# EAGLE design N64_RX_V2.0 (EAGLE 7.6.0)
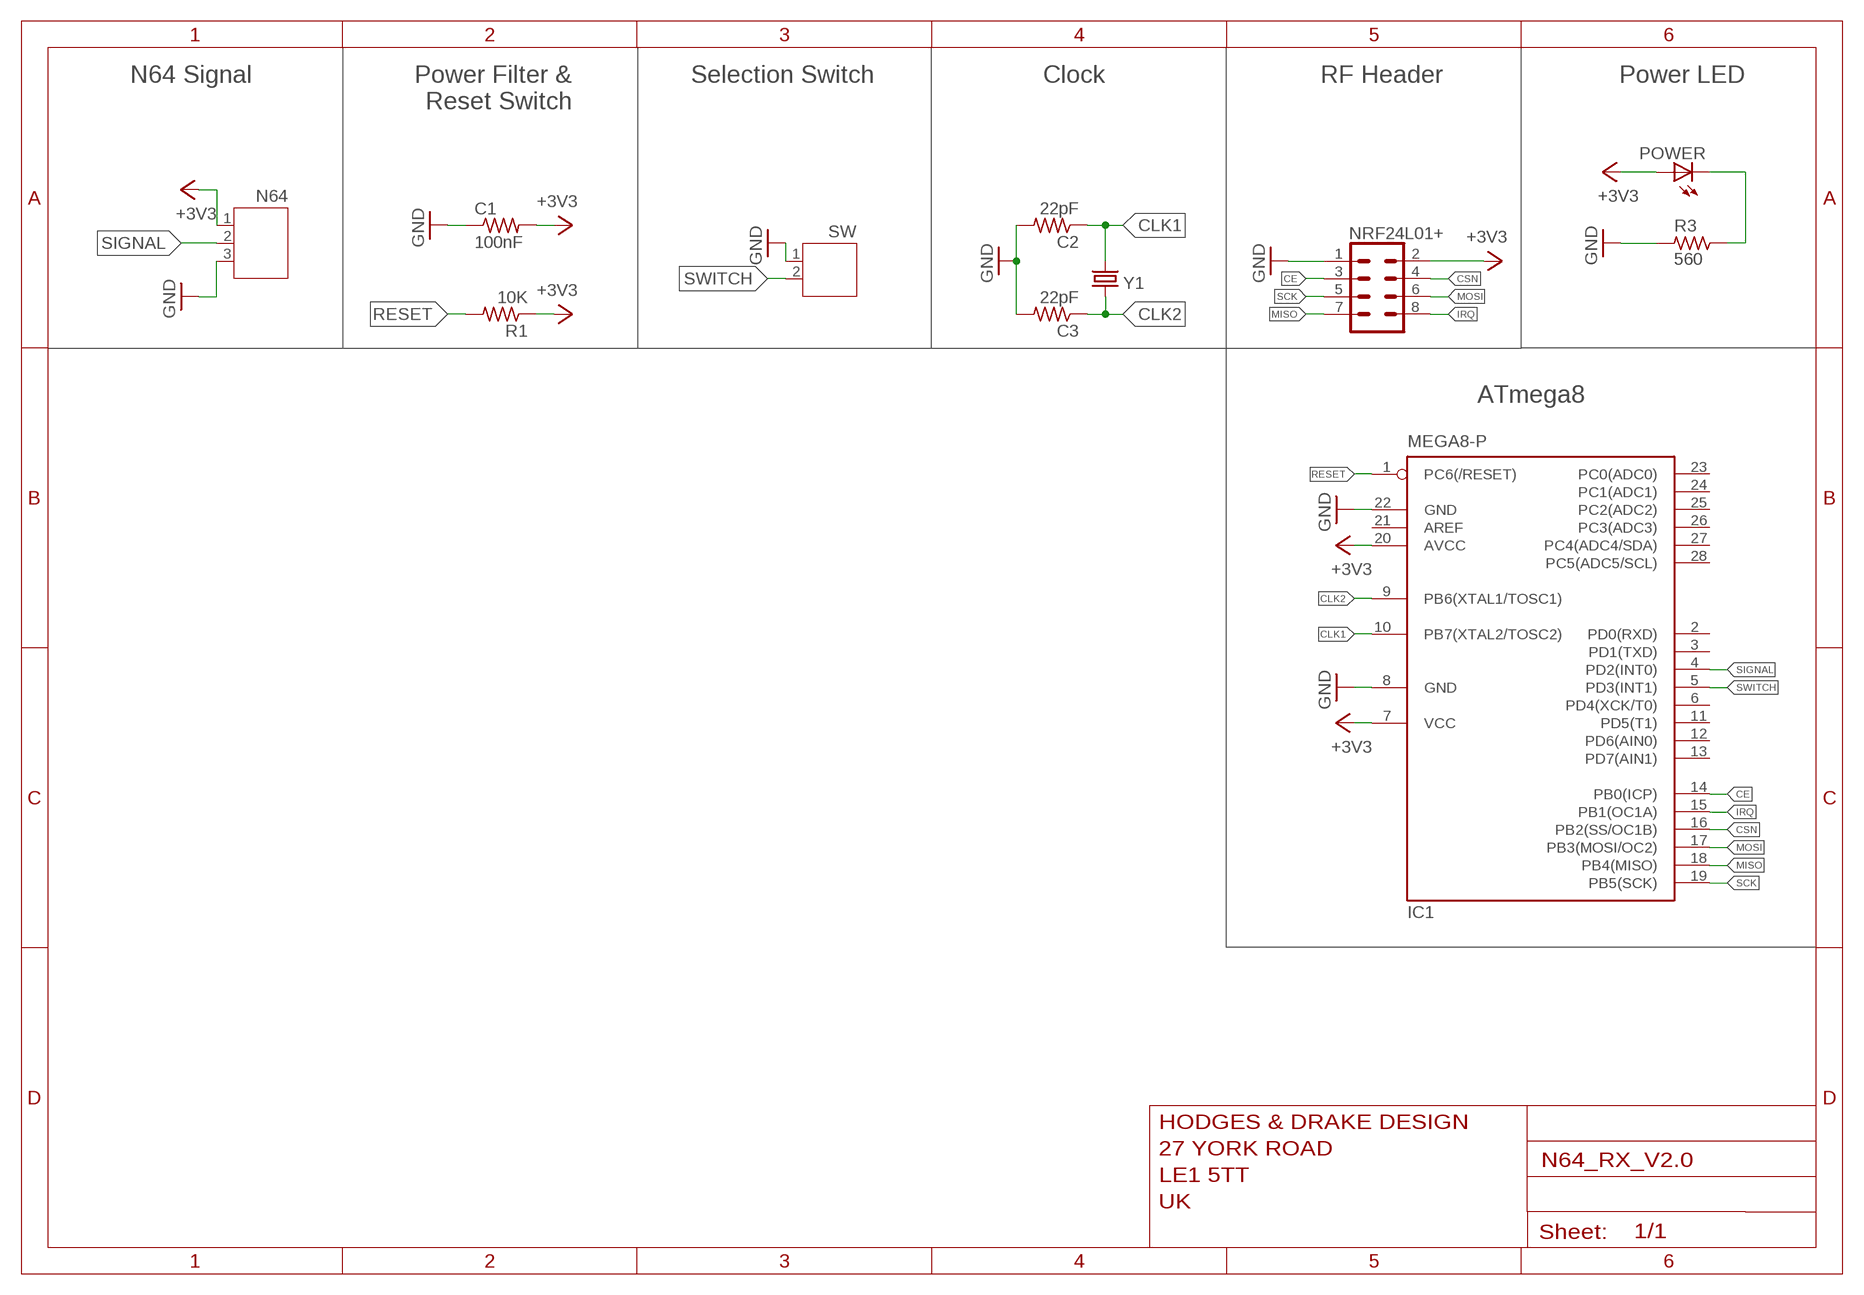
[diagram p0: schematic, sheet 1]

## Parts
C1  100nF  FLIPFLOP-RES  [0805-THM]
C2  22pF  FLIPFLOP-RES  [0805-THM]
C3  22pF  FLIPFLOP-RES  [0805-THM]
IC1  MEGA8-P  [DIL28-3]
N64  JST-PH3TH  [JST-PH3]
NRF24L01+  CONN_04X2  [2X4]
POWER  LEDCHIPLED_0805  [CHIPLED_0805]
R1  10K  FLIPFLOP-RES  [0805-THM]
R3  560  R_0805  [R0805]
SW  JST-PH2TH  [JST-PH2]
Y1  CRYSTALHC49S  [HC49/S]

## Nets
+3V3: C1.2 IC1.7(VCC) IC1.20(AVCC) N64.1 NRF24L01+.2 POWER.A R1.1
CE: IC1.14(PB0(ICP)) NRF24L01+.3
CLK1: C2.1 IC1.10(PB7(XTAL2/TOSC2)) Y1.2
CLK2: C3.1 IC1.9(PB6(XTAL1/TOSC1)) Y1.1
CSN: IC1.16(PB2(SS/OC1B)) NRF24L01+.4
GND: C1.1 C2.2 C3.2 IC1.8(GND) IC1.22(GND) N64.3 NRF24L01+.1 R3.1 SW.1
IRQ: IC1.15(PB1(OC1A)) NRF24L01+.8
MISO: IC1.18(PB4(MISO)) NRF24L01+.7
MOSI: IC1.17(PB3(MOSI/OC2)) NRF24L01+.6
N$5: POWER.C R3.2
RESET: IC1.1(PC6(/RESET)) R1.2
SCK: IC1.19(PB5(SCK)) NRF24L01+.5
SIGNAL: IC1.4(PD2(INT0)) N64.2
SWITCH: IC1.5(PD3(INT1)) SW.2
Unconnected: IC1.2(PD0(RXD)) IC1.3(PD1(TXD)) IC1.6(PD4(XCK/T0)) IC1.11(PD5(T1)) IC1.12(PD6(AIN0)) IC1.13(PD7(AIN1)) IC1.21(AREF) IC1.23(PC0(ADC0)) IC1.24(PC1(ADC1)) IC1.25(PC2(ADC2)) IC1.26(PC3(ADC3)) IC1.27(PC4(ADC4/SDA)) IC1.28(PC5(ADC5/SCL))

## Notes on the sheet
- N64 Signal
- Power Filter &
  Reset Switch
- Selection Switch | Clock | RF Header | Power LED
- ATmega8

## Library data of the parts
C1-C3 R1 = adafruit:FLIPFLOP-RES: Flip Flop resistor An 0805 resistor inside a standard 1/4W 5% resistor. Makes for easy mods
IC1 = atmel:MEGA8-P: MICROCONTROLLER 8 Kbytes FLASH, 1 kbytes SRAM, 512 bytes EEPROM, USART, 4-channel 10 bit ADC, 2-channel 8 bit ADC Pin compatible with Atmega48, ATMega88, ATMega168 Source: avr.lbr
N64 = con-jst-ph:JST-PH3
NRF24L01+ = SparkFun-Connectors:CONN_04X2: Multi connection point. Often used as Generic Header-pin footprint for 0.1 inch spaced/style header connections On any of the 0.1 inch spaced packages, you can populate with these: Break Away Headers - Straight <https://www.sparkfun.com/products/116> (PRT-00116) Break Away Male Headers - Right Angle <https://www.sparkfun.com/products/553> (PRT-00553) Female Headers <https://www.sparkfun.com/products/115> (PRT-00115) Break Away Headers - Machine Pin <https://www.sparkfun.com/products/117> (PRT-00117) Break Away Female Headers - Swiss Machine Pin <https://www.sparkfun.com/products/743> (PRT-00743)
POWER = adafruit:LED: LED OSRAM: - CHIPLED LG R971, LG N971, LY N971, LG Q971, LY Q971, LO R971, LY R971 LH N974, LH R974 LS Q976, LO Q976, LY Q976 LO Q996 - Hyper CHIPLED LW Q18S LB Q993, LB Q99A, LB R99A - SideLED LS A670, LO A670, LY A670, LG A670, LP A670 LB A673, LV A673, LT A673, LW A673 LH A674 LY A675 LS A676, LA A676, LO A676, LY A676, LW A676 LS A679, LY A679, LG A679 - Hyper Micro SIDELED® LS Y876, LA Y876, LO Y876, LY Y876 LT Y87S - SmartLED LW L88C, LW L88S LB L89C, LB L89S, LG L890 LS L89K, LO L89K, LY L89K LS L896, LA L896, LO L896, LY L896 - TOPLED LS T670, LO T670, LY T670, LG T670, LP T670 LSG T670, LSP T670, LSY T670, LOP T670, LYG T670 LG T671, LOG T671, LSG T671 LB T673, LV T673, LT T673, LW T673 LH T674 LS T676, LA T676, LO T676, LY T676, LB T676, LH T676, LSB T676, LW T676 LB T67C, LV T67C, LT T67C, LS T67K, LO T67K, LY T67K, LW E67C LS E67B, LA E67B, LO E67B, LY E67B, LB E67C, LV E67C, LT E67C LW T67C LS T679, LY T679, LG T679 LS T770, LO T770, LY T770, LG T770, LP T770 LB T773, LV T773, LT T773, LW T773 LH T774 LS E675, LA E675, LY E675, LS T675 LS T776, LA T776, LO T776, LY T776, LB T776 LHGB T686 LT T68C, LB T68C - Hyper Mini TOPLED® LB M676 - Mini TOPLED Santana® LG M470 LS M47K, LO M47K, LY M47K Source: http://www.osram.convergy.de/
R3 = rc-master-smd:R_: RESISTOR
SW = con-jst-ph:JST-PH2
Y1 = adafruit:CRYSTAL: CRYSTAL; OC_FARNELL: 1667008; OC_NEWARK: unknown

## Board
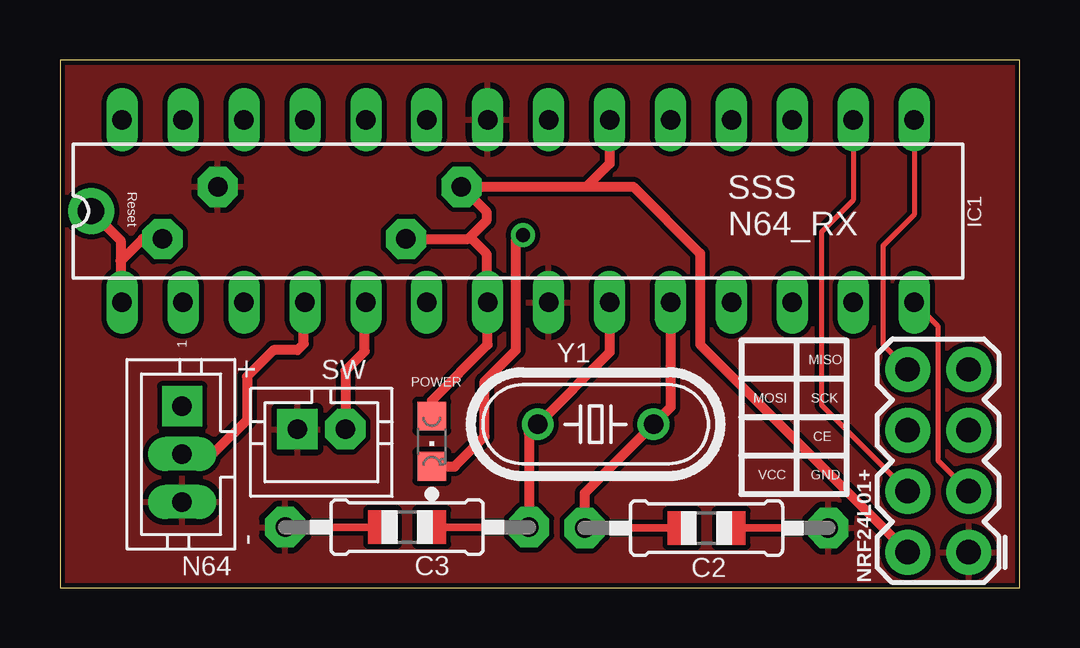
[diagram p1: board, top side]
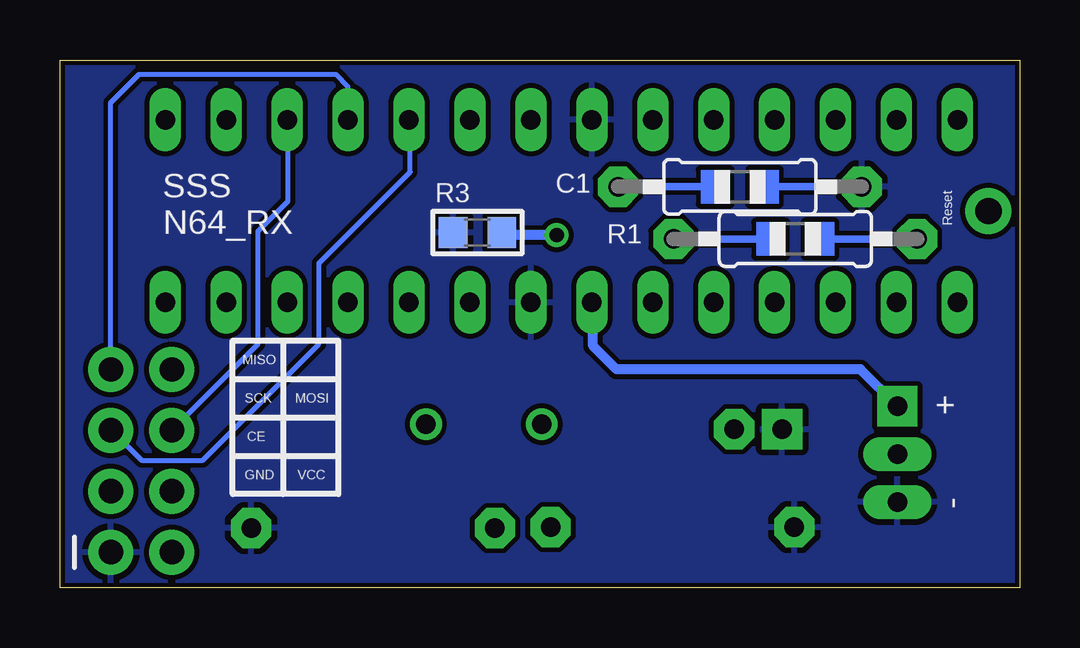
[diagram p2: board, bottom side, seen from below]

Size 40 x 22 mm. Coordinates in mm from the lower left corner, seen from the top.
Outline: 0,0 40,0 40,22 0,22 0,0
Copper layers (1*16): Top 0.035mm / dielectric 1.5mm / Bottom 0.035mm
Design rules "default *": minimum track width 0.19mm, minimum drill 0.015240625mm, track to track 8mil, track to pad 8mil, pad to pad 8mil, via to via 8mil, smd to smd 8mil, copper to edge 0.2mm, drill to drill 8mil, minimum pad ring 10mil, minimum via ring 8mil, stop-mask expansion 4mil, vias tented up to drill 0mil, thermal gap 10mil

### Footprints (pad centres in the part's own frame; a part is rotated, then mirrored left to right if it is on the bottom)
0805-THM = drill 0.813 pad 1.676 octagon: 1 -5.08,0; 2 5.08,0
DIL28-3 = drill 0.813 long: 1 -16.51,-3.81; 2 -13.97,-3.81; 3 -11.43,-3.81; 4 -8.89,-3.81; 5 -6.35,-3.81; 6 -3.81,-3.81; 7 -1.27,-3.81; 8 1.27,-3.81; 9 3.81,-3.81; 10 6.35,-3.81; 11 8.89,-3.81; 12 11.43,-3.81; 13 13.97,-3.81; 14 16.51,-3.81; 15 16.51,3.81; 16 13.97,3.81; 17 11.43,3.81; 18 8.89,3.81; 19 6.35,3.81; 20 3.81,3.81; 21 1.27,3.81; 22 -1.27,3.81; 23 -3.81,3.81; 24 -6.35,3.81; 25 -8.89,3.81; 26 -11.43,3.81; 27 -13.97,3.81; 28 -16.51,3.81
JST-PH3 = drill 0.813 pad 1.676 square: 1 1.73,0.508 | drill 0.813 pad 1.422 long: 2 -0.27,0.508; 3 -2.27,0.508
2X4 = drill 1.016 pad 1.88: 1 -3.81,-1.27; 2 -3.81,1.27; 3 -1.27,-1.27; 4 -1.27,1.27; 5 1.27,-1.27; 6 1.27,1.27; 7 3.81,-1.27; 8 3.81,1.27
CHIPLED_0805 = smd 1.2 x 1.2: A 0,-1.05; C 0,1.05
R0805 = smd 1.2 x 1.3: 1 -1.016,0; 2 1.016,0
JST-PH2 = drill 0.813 pad 1.676 square: 1 1,0 | drill 0.813 pad 1.676 octagon: 2 -1,0
HC49/S = drill 0.813: 1 -2.413,0; 2 2.413,0

### Placement (x,y rotation side)
C1  11.66,16.71 180 bottom
C2  26.95,2.48 0 top
C3  14.47,2.52 180 top
IC1  19.1,15.7 0 top
N64  5.6,5.83 90 top
NRF24L01+  36.61,5.29 90 top
POWER  15.5,6.1 180 top
R1  9.35,14.54 0 bottom
R3  22.6,14.8 0 bottom
SW  10.9,6.6 180 top
Y1  22.33,6.81 0 top

### Tracks (layer width: path | path; a pad name or v marks a point on that pad's centre or on a via)
+3V3
  Top 0.406: C1.2 17.78,15.67 17.78,15.3 17.09,14.61 | 16.6,16.71 C1.2 | C1.2 21.95,16.71 | 21.95,16.71 22.91,17.67 IC1.20 | 21.95,16.71 23.9,16.71 26.68,13.93 26.68,10.14 NRF24L01+.2 | R1.1 17.02,14.54 17.09,14.61 | 17.09,14.61 17.78,13.92 17.78,11.94 IC1.7 17.83,10.13 15.5,7.8 POWER.A
  Bottom 0.406: N64.1 6.63,9.1 16.8,9.1 17.78,10.08 17.78,11.84 IC1.7
CE
  Top 0.2: NRF24L01+.3 36.6,5.3 36.6,10.9 IC1.14
CLK1
  Top 0.406: C2.1 21.87,3.94 Y1.2 25.45,7.52 IC1.10
CLK2
  Top 0.406: C3.1 19.55,6.44 Y1.1 22.91,9.8 IC1.9
CSN
  Top 0.2: NRF24L01+.4 31.76,7.6 31.76,14.84 33.07,16.15 IC1.16
GND
  pour Bottom: 0,0 0,22 40,22 40,0
  pour Top: 0,0 0,22 40,22 40,0
IRQ
  Top 0.2: NRF24L01+.8 34.32,10.12 34.32,14.27 35.17,15.12 35.57,15.52 35.61,15.56 IC1.15
MISO
  Bottom 0.2: NRF24L01+.7 37.88,20.22 36.7,21.4 28.5,21.4 27.99,20.89 IC1.18
MOSI
  Bottom 0.2: NRF24L01+.6 31.75,10.15 31.75,14.86 30.5,16.11 30.5,19.48 IC1.17
N$5  (via drill 0.6)
  Top 0.406: POWER.C 16.45,5.05 17.7,6.3 17.7,8.6 19,9.9 19,14.4 arc-90 v19.3,14.7
  Bottom 0.406: v19.3,14.7 21.48,14.7 arc90 R3.2
RESET  (via drill 1.1 pad 1.93)
  Top 0.406: R1.2 3.45,14.54 2.53,13.62 | 2.53,13.62 2.53,11.88 IC1.1 | v1.3,15.7 2.53,14.47 2.53,13.62
SCK
  Bottom 0.2: NRF24L01+.5 37.85,6.56 36.6,5.31 34.05,5.31 29.2,10.16 29.2,13.53 25.4,17.33 25.4,19.46 IC1.19
SIGNAL
  Top 0.406: N64.2 6.36,5.56 7.8,7 7.8,8.8 8.9,9.9 9.9,9.9 10.16,10.16 10.16,11.84 IC1.4
SWITCH
  Top 0.406: SW.2 11.9,9.05 12.7,9.85 12.7,11.84 IC1.5

### Text on the board
tPlace: Reset | SSS / N64_RX | + | MISO | MOSI | SCK | CE | VCC | GND | -
bPlace: Reset | SSS / N64_RX | MISO | MOSI | SCK | + | CE | - | VCC | GND